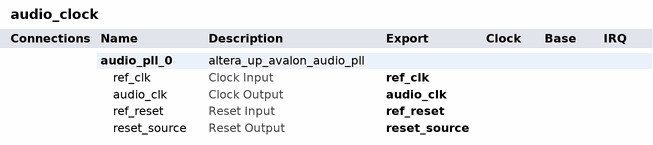
[diagram p0: system contents]
# Platform Designer (Qsys) system audio_clock, Cyclone IV E EP4CE115F29C7
# Parameters at their usual value, and those the tool derives, are not listed.
package require -exact qsys 15.1
create_system audio_clock
set_project_property DEVICE_FAMILY {Cyclone IV E}
set_project_property DEVICE EP4CE115F29C7

add_instance audio_pll_0 altera_up_avalon_audio_pll 15.1
set_instance_property audio_pll_0 AUTO_EXPORT true
set_instance_parameter_value audio_pll_0 gui_refclk 50.0

# exported interfaces
add_interface audio_clk clock source
set_interface_property audio_clk EXPORT_OF audio_pll_0.audio_clk
add_interface ref_clk clock sink
set_interface_property ref_clk EXPORT_OF audio_pll_0.ref_clk
add_interface ref_reset reset sink
set_interface_property ref_reset EXPORT_OF audio_pll_0.ref_reset
add_interface reset_source reset source
set_interface_property reset_source EXPORT_OF audio_pll_0.reset_source

set_interconnect_requirement {$system} qsys_mm.clockCrossingAdapter HANDSHAKE
set_interconnect_requirement {$system} qsys_mm.enableEccProtection FALSE
set_interconnect_requirement {$system} qsys_mm.insertDefaultSlave FALSE
set_interconnect_requirement {$system} qsys_mm.maxAdditionalLatency 1

save_system audio_clock.qsys
